# Altium schematic sheet Hierarchi.SchDoc
size A
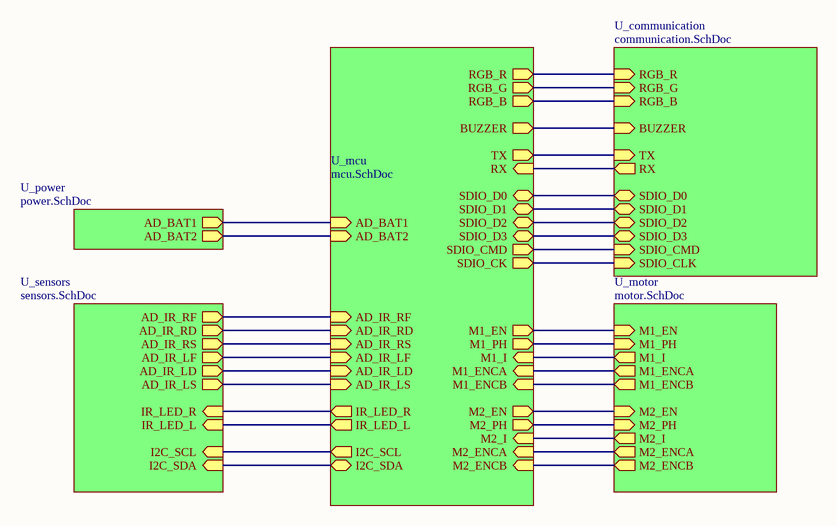
[diagram p0: Hierarchi.SchDoc]

## Sub-sheets
U_communication = communication.SchDoc: BUZZER (in), RGB_R (in), RGB_B (in), RGB_G (in), SDIO_D2 (bidir), SDIO_D3 (bidir), SDIO_CMD (in), SDIO_CLK (in), SDIO_D0 (bidir), SDIO_D1 (bidir), RX (out), TX (in)
U_mcu = mcu.SchDoc: AD_IR_LF (in), AD_IR_RF (in), AD_IR_LS (in), AD_IR_RS (in), AD_IR_RD (in), AD_IR_LD (in), M1_ENCA (in), M1_ENCB (in), M1_EN (out), M1_PH (out), M1_I (in), M2_EN (out), AD_BAT1 (in), AD_BAT2 (in), M2_PH (out), M2_I (in), M2_ENCA (in), M2_ENCB (in), I2C_SCL (out), I2C_SDA (bidir), IR_LED_L (out), IR_LED_R (out), SDIO_D3 (bidir), RX (in), RGB_R (out), BUZZER (out), RGB_G (out), TX (out), SDIO_D1 (bidir), SDIO_CK (out), SDIO_D0 (bidir), RGB_B (out), SDIO_CMD (out), SDIO_D2 (bidir)
U_motor = motor.SchDoc: M1_EN (in), M1_PH (in), M1_I (out), M1_ENCA (out), M1_ENCB (out), M2_EN (in), M2_PH (in), M2_I (out), M2_ENCA (out), M2_ENCB (out)
U_power = power.SchDoc: AD_BAT1 (out), AD_BAT2 (out)
U_sensors = sensors.SchDoc: AD_IR_LF (out), AD_IR_RD (out), AD_IR_LS (out), AD_IR_RS (out), AD_IR_LD (out), AD_IR_RF (out), I2C_SDA (in), I2C_SCL (in), IR_LED_L (in), IR_LED_R (in)

## Nets
(unnamed): sheet U_mcu/AD_IR_LF, sheet U_sensors/AD_IR_LF
(unnamed): sheet U_mcu/AD_IR_RF, sheet U_sensors/AD_IR_RF
(unnamed): sheet U_mcu/AD_IR_LS, sheet U_sensors/AD_IR_LS
(unnamed): sheet U_mcu/AD_IR_RS, sheet U_sensors/AD_IR_RS
(unnamed): sheet U_mcu/AD_IR_RD, sheet U_sensors/AD_IR_RD
(unnamed): sheet U_mcu/AD_IR_LD, sheet U_sensors/AD_IR_LD
(unnamed): sheet U_mcu/M1_ENCA, sheet U_motor/M1_ENCA
(unnamed): sheet U_mcu/M1_ENCB, sheet U_motor/M1_ENCB
(unnamed): sheet U_mcu/M1_EN, sheet U_motor/M1_EN
(unnamed): sheet U_mcu/M1_PH, sheet U_motor/M1_PH
(unnamed): sheet U_mcu/M1_I, sheet U_motor/M1_I
(unnamed): sheet U_mcu/M2_EN, sheet U_motor/M2_EN
(unnamed): sheet U_mcu/AD_BAT1, sheet U_power/AD_BAT1
(unnamed): sheet U_mcu/AD_BAT2, sheet U_power/AD_BAT2
(unnamed): sheet U_mcu/M2_PH, sheet U_motor/M2_PH
(unnamed): sheet U_mcu/M2_I, sheet U_motor/M2_I
(unnamed): sheet U_mcu/M2_ENCA, sheet U_motor/M2_ENCA
(unnamed): sheet U_mcu/M2_ENCB, sheet U_motor/M2_ENCB
(unnamed): sheet U_mcu/I2C_SCL, sheet U_sensors/I2C_SCL
(unnamed): sheet U_mcu/I2C_SDA, sheet U_sensors/I2C_SDA
(unnamed): sheet U_mcu/IR_LED_L, sheet U_sensors/IR_LED_L
(unnamed): sheet U_mcu/IR_LED_R, sheet U_sensors/IR_LED_R
(unnamed): sheet U_mcu/SDIO_D3, sheet U_communication/SDIO_D3
(unnamed): sheet U_mcu/RX, sheet U_communication/RX
(unnamed): sheet U_mcu/RGB_R, sheet U_communication/RGB_R
(unnamed): sheet U_mcu/BUZZER, sheet U_communication/BUZZER
(unnamed): sheet U_mcu/RGB_G, sheet U_communication/RGB_G
(unnamed): sheet U_mcu/TX, sheet U_communication/TX
(unnamed): sheet U_mcu/SDIO_D1, sheet U_communication/SDIO_D1
(unnamed): sheet U_mcu/SDIO_CK, sheet U_communication/SDIO_CLK
(unnamed): sheet U_mcu/SDIO_D0, sheet U_communication/SDIO_D0
(unnamed): sheet U_mcu/RGB_B, sheet U_communication/RGB_B
(unnamed): sheet U_mcu/SDIO_CMD, sheet U_communication/SDIO_CMD
(unnamed): sheet U_mcu/SDIO_D2, sheet U_communication/SDIO_D2